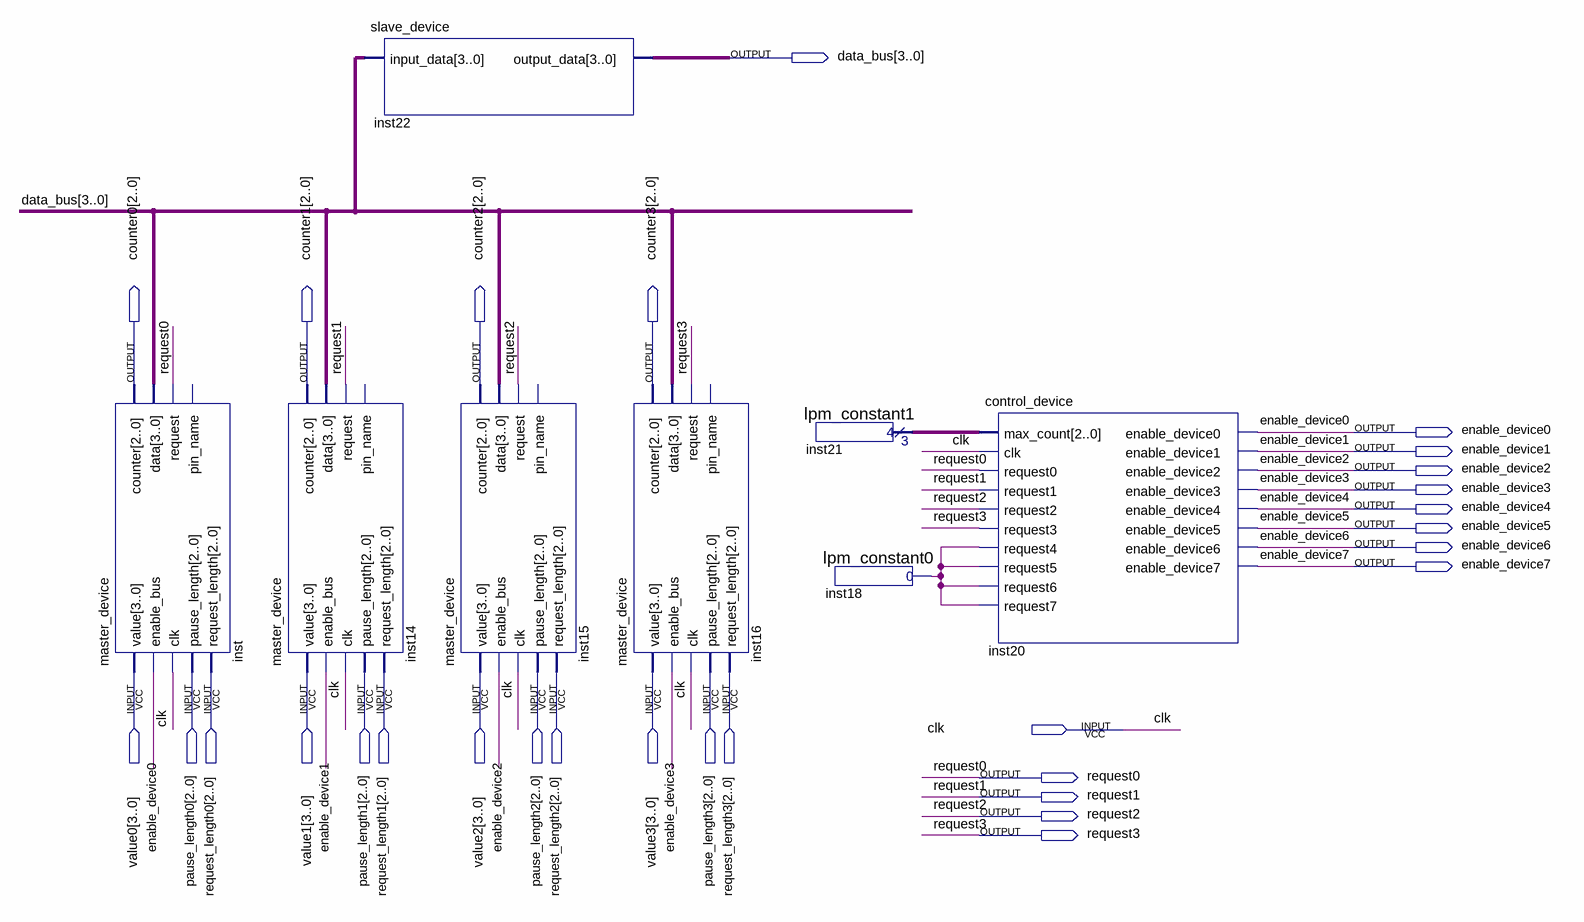
[diagram p0: schematic sheet]
// Quartus schematic LAB_5_3.bdf as structural Verilog: 8 symbols, 30 pins
module LAB_5_3 (
  input  [3:0] value0,
  input  [2:0] pause_length0,
  input  [2:0] request_length0,
  input  [3:0] value1,
  input  [2:0] pause_length1,
  input  [2:0] request_length1,
  input  [3:0] value2,
  input  [2:0] pause_length2,
  input  [2:0] request_length2,
  input  [3:0] value3,
  input  [2:0] pause_length3,
  input  [2:0] request_length3,
  input  clk,
  output [3:0] data_bus,
  output [2:0] counter0,
  output [2:0] counter1,
  output [2:0] counter2,
  output [2:0] counter3,
  output enable_device0,
  output enable_device1,
  output enable_device2,
  output enable_device3,
  output enable_device4,
  output enable_device5,
  output enable_device6,
  output enable_device7,
  output request0,
  output request1,
  output request2,
  output request3
);

  wire inst18_result;
  wire [2:0] inst21_result;

  master_device inst (
    .value(value0), .enable_bus(enable_device0), .clk(clk), .pause_length(pause_length0),
    .request_length(request_length0), .counter(counter0), .data(data_bus), .request(request0));  // open: pin_name
  master_device inst14 (
    .value(value1), .enable_bus(enable_device1), .clk(clk), .pause_length(pause_length1),
    .request_length(request_length1), .counter(counter1), .data(data_bus), .request(request1));  // open: pin_name
  slave_device inst22 (.input_data(data_bus), .output_data(data_bus));
  master_device inst15 (
    .value(value2), .enable_bus(enable_device2), .clk(clk), .pause_length(pause_length2),
    .request_length(request_length2), .counter(counter2), .data(data_bus), .request(request2));  // open: pin_name
  master_device inst16 (
    .value(value3), .enable_bus(enable_device3), .clk(clk), .pause_length(pause_length3),
    .request_length(request_length3), .counter(counter3), .data(data_bus), .request(request3));  // open: pin_name
  lpm_constant1 inst21 (.result(inst21_result));
  lpm_constant0 inst18 (.result(inst18_result));
  control_device inst20 (
    .max_count(inst21_result), .clk(clk), .request0(request0), .request1(request1), .request2(request2),
    .request3(request3), .request4(inst18_result), .request5(inst18_result), .request6(inst18_result),
    .request7(inst18_result), .enable_device0(enable_device0), .enable_device1(enable_device1),
    .enable_device2(enable_device2), .enable_device3(enable_device3), .enable_device4(enable_device4),
    .enable_device5(enable_device5), .enable_device6(enable_device6), .enable_device7(enable_device7));
endmodule
